# EAGLE design PJ24 (EAGLE 7.4.0)

## Sheet 1 of 4: AFE4404
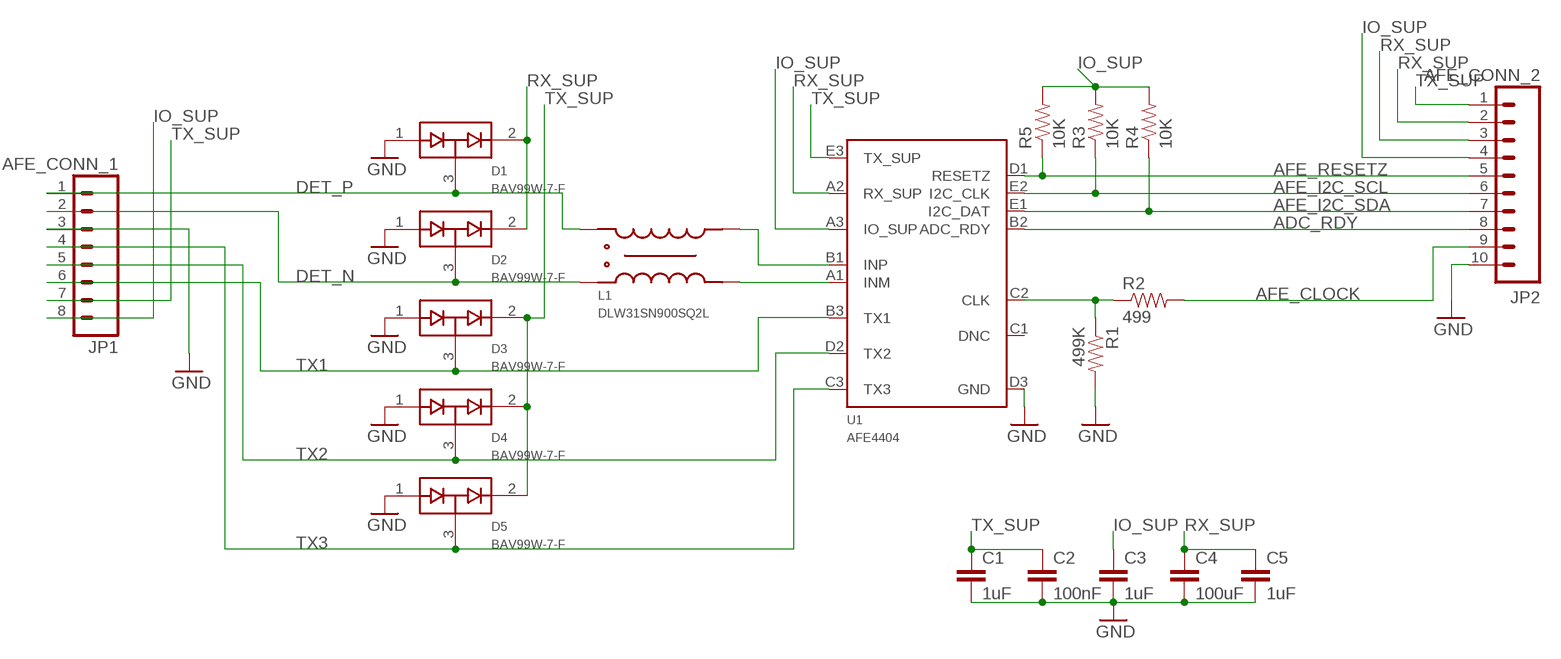
[diagram p0: schematic, sheet 1]

### Parts
C1  1uF  CAP0402-S  [0402-S]
C2  100nF  CAP0402-S  [0402-S]
C3  1uF  CAP0402-S  [0402-S]
C4  100uF  CAP0402-S  [0402-S]
C5  1uF  CAP0402-S  [0402-S]
D1  BAV99W-7-F  BAV99W  [SOT323]
D2  BAV99W-7-F  BAV99W  [SOT323]
D3  BAV99W-7-F  BAV99W  [SOT323]
D4  BAV99W-7-F  BAV99W  [SOT323]
D5  BAV99W-7-F  BAV99W  [SOT323]
JP1  AFE_CONN_1  M08BM08B-SRSS-TB  [BM08B-SRSS-TB]
JP2  AFE_CONN_2  M10SMD_MALE  [1X10_SMD_MALE]
L1  DLW31SN900SQ2L  [DLW31SN900SQ2L]
R1  499K  RESISTOR0402-S  [0402-S]
R2  499  RESISTOR0402-S  [0402-S]
R3  10K  RESISTOR0402-S  [0402-S]
R4  10K  RESISTOR0402-S  [0402-S]
R5  10K  RESISTOR0402-S  [0402-S]
U1  AFE4404  [DSBGA-3X5]

### Nets
ADC_RDY: JP2.8 U1.B2(ADC_RDY) ; also sheet 2
AFE_CLOCK: JP2.9 R2.2 ; also sheet 2
AFE_I2C_SCL: JP2.6 R3.1 U1.E2(I2C_CLK) ; also sheet 2
AFE_I2C_SDA: JP2.7 R4.1 U1.E1(I2C_DAT) ; also sheet 2
AFE_RESETZ: JP2.5 R5.1 U1.D1(RESETZ) ; also sheet 2
DET_N: D2.3(COM) JP1.2 L1.4 ; also sheet 4
DET_P: D1.3(COM) JP1.1 L1.1 ; also sheet 4
GND: C1.2 C2.2 C3.2 C4.2 C5.2 D1.1(A1) D2.1(A1) D3.1(A1) D4.1(A1) D5.1(A1) JP1.3 JP2.10 R1.2 U1.D3(GND) ; also sheet 2,3,4
IO_SUP: C3.1 JP1.8 JP2.4 R3.2 R4.2 R5.2 U1.A3(IO_SUP) ; also sheet 3,4
N$1: L1.2 U1.B1(INP)
N$2: L1.3 U1.A1(INM)
N$3: R1.1 R2.1 U1.C2(CLK)
RX_SUP: C4.1 C5.1 D1.2(C2) D2.2(C2) JP2.2 JP2.3 U1.A2(RX_SUP) ; also sheet 3
TX1: D3.3(COM) JP1.6 U1.B3(TX1) ; also sheet 4
TX2: D4.3(COM) JP1.5 U1.D2(TX2) ; also sheet 4
TX3: D5.3(COM) JP1.4 U1.C3(TX3) ; also sheet 4
TX_SUP: C1.1 C2.1 D3.2(C2) D4.2(C2) D5.2(C2) JP1.7 JP2.1 U1.E3(TX_SUP) ; also sheet 3,4
Unconnected: U1.C1(DNC)

## Sheet 2 of 4: Microcontroller
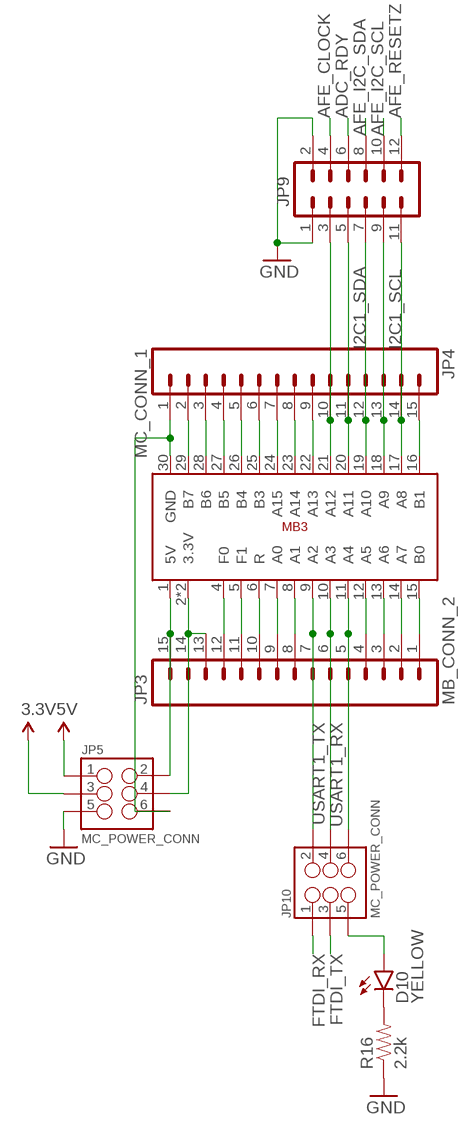
[diagram p1: schematic, sheet 2]

### Parts
D10  YELLOW  LED-YELLOW1206  [LED-1206]
JP3  MB_CONN_2  M15LOCK  [1X15_LOCK]
JP4  MC_CONN_1  M15LOCK  [1X15_LOCK]
JP5  MC_POWER_CONN  M03X2SMT  [2X3_SMT_POSTS]
JP9  M06X2FEMALE-SMT  [2X6_SMD]
JP10  MC_POWER_CONN  M03X2SMT  [2X3_SMT_POSTS]
R16  2.2k  2.2KOHM-1/10W-1%(0603)  [0603-RES]
U2  MB3  [MB3]

### Nets
3.3V: JP5.3 ; also sheet 3
5V: JP5.1 ; also sheet 3
ADC_RDY: JP9.6 ; also sheet 1
AFE_CLOCK: JP9.4 ; also sheet 1
AFE_I2C_SCL: JP9.10 ; also sheet 1
AFE_I2C_SDA: JP9.8 ; also sheet 1
AFE_RESETZ: JP9.12 ; also sheet 1
FTDI_RX: JP10.1 ; also sheet 3
FTDI_TX: JP10.3 ; also sheet 3
GND: JP5.5 JP9.1 JP9.2 R16.1 ; also sheet 1,3,4
I2C1_SCL: JP4.13 JP9.9 U2.18(A9)
I2C1_SDA: JP4.12 JP9.7 U2.19(A10)
N$4: JP3.15 JP5.2 U2.1(5V)
N$5: JP3.13 JP3.14 JP5.4 U2.2(3.3V) U2.3(3.3V)
N$6: JP3.12 U2.4(F0)
N$7: JP3.11 U2.5(F1)
N$8: JP3.10 U2.6(R)
N$9: JP3.9 U2.7(A0)
N$10: JP3.8 U2.8(A1)
N$11: D10.C R16.2
N$12: D10.A JP10.5
N$13: JP3.5 JP10.6 U2.11(A4)
N$14: JP3.4 U2.12(A5)
N$15: JP3.3 U2.13(A6)
N$16: JP3.2 U2.14(A7)
N$17: JP3.1 U2.15(B0)
N$18: JP4.1 JP5.6 U2.30(GND)
N$19: JP4.2 U2.29(B7)
N$20: JP4.3 U2.28(B6)
N$21: JP4.4 U2.27(B5)
N$22: JP4.5 U2.26(B4)
N$23: JP4.6 U2.25(B3)
N$24: JP4.7 U2.24(A15)
N$25: JP4.8 U2.23(A14)
N$26: JP4.9 U2.22(A13)
N$27: JP4.10 JP9.3 U2.21(A12)
N$28: JP4.11 JP9.5 U2.20(A11)
N$31: JP4.14 JP9.11 U2.17(A8)
N$32: JP4.15 U2.16(B1)
USART1_RX: JP3.6 JP10.4 U2.10(A3)
USART1_TX: JP3.7 JP10.2 U2.9(A2)

## Sheet 3 of 4: Power
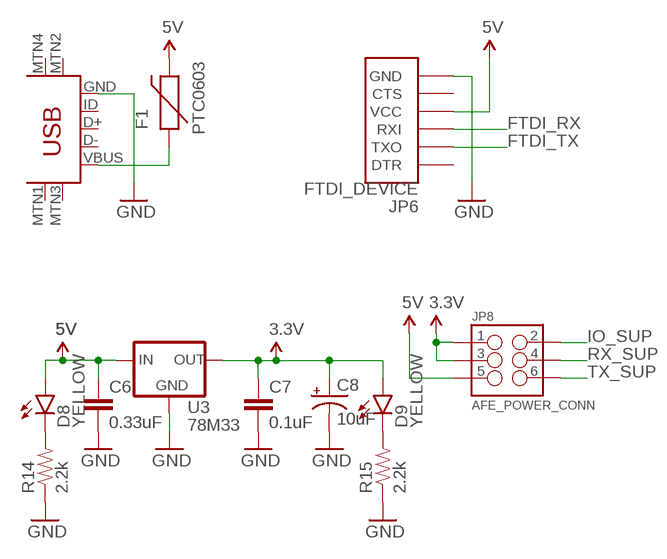
[diagram p2: schematic, sheet 3]

### Parts
C6  0.33uF  0.33UF-50V-10%(0805)  [0805-CAP]
C7  0.1uF  0.33UF-50V-10%(0805)  [0805-CAP]
C8  10uF  10UF-16V-10%(TANT)  [EIA3216]
D8  YELLOW  LED-YELLOW1206  [LED-1206]
D9  YELLOW  LED-YELLOW1206  [LED-1206]
F1  PTC0603  [0603]
JP6  FTDI_DEVICE  [FTDI_DEVICE_SIDE]
JP8  AFE_POWER_CONN  M03X2SMT  [2X3_SMT_POSTS]
R14  2.2k  2.2KOHM-1/10W-1%(0603)  [0603-RES]
R15  2.2k  2.2KOHM-1/10W-1%(0603)  [0603-RES]
U3  78M33  V_REG_78XX7812  [TO-252]
U$1  USB-MINIB-5PIN  [USB-MINIB]

### Nets
3.3V: C7.1 C8.A(+) D9.A JP8.1 JP8.3 U3.2(OUT) ; also sheet 2
5V: C6.1 D8.A F1.2 JP6.P$4(VCC) JP8.5 U3.1(IN) ; also sheet 2
FTDI_RX: JP6.P$3(RXI) ; also sheet 2
FTDI_TX: JP6.P$2(TXO) ; also sheet 2
GND: C6.2 C7.2 C8.C(-) JP6.P$6(GND) R14.1 R15.1 U3.3(GND) U$1.GND ; also sheet 1,2,4
IO_SUP: JP8.2 ; also sheet 1,4
N$42: D8.C R14.2
N$43: D9.C R15.2
N$44: F1.1 U$1.VBUS
RX_SUP: JP8.4 ; also sheet 1
TX_SUP: JP8.6 ; also sheet 1,4
Unconnected: JP6.P$1(DTR) JP6.P$5(CTS) U$1.D+ U$1.D- U$1.ID U$1.MTN1(MTN2) U$1.MTN2(MTN3) U$1.MTN3(MTN1) U$1.MTN4

## Sheet 4 of 4: LED
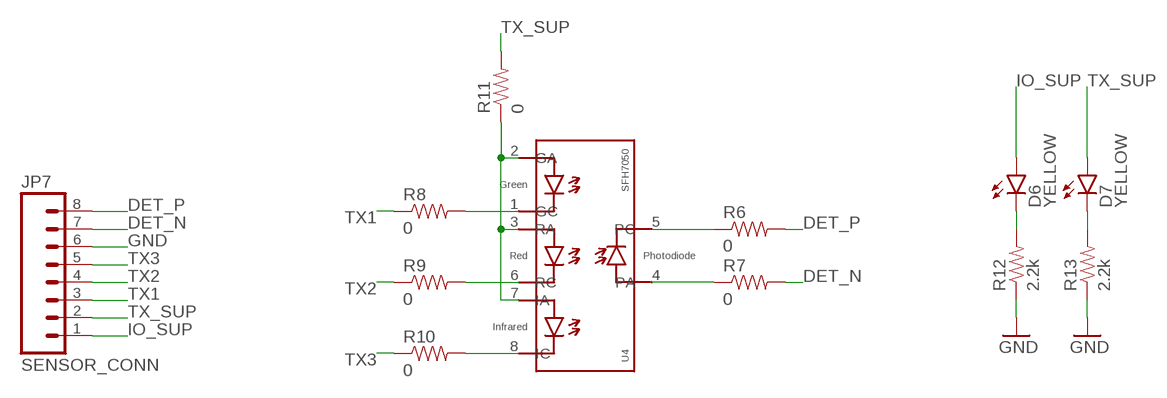
[diagram p3: schematic, sheet 4]

### Parts
D6  YELLOW  LED-YELLOW1206  [LED-1206]
D7  YELLOW  LED-YELLOW1206  [LED-1206]
JP7  SENSOR_CONN  M08BM08B-SRSS-TB  [BM08B-SRSS-TB]
R6  0  RESISTOR0402-S  [0402-S]
R7  0  RESISTOR0402-S  [0402-S]
R8  0  RESISTOR0402-S  [0402-S]
R9  0  RESISTOR0402-S  [0402-S]
R10  0  RESISTOR0402-S  [0402-S]
R11  0  RESISTOR0402-S  [0402-S]
R12  2.2k  2.2KOHM-1/10W-1%(0603)  [0603-RES]
R13  2.2k  2.2KOHM-1/10W-1%(0603)  [0603-RES]
U4  SFH7050  [SFH7050]

### Nets
DET_N: JP7.7 R7.2 ; also sheet 1
DET_P: JP7.8 R6.2 ; also sheet 1
GND: JP7.6 R12.1 R13.1 ; also sheet 1,2,3
IO_SUP: D6.A JP7.1 ; also sheet 1,3
N$33: R9.2 U4.6(RC)
N$34: R11.1 U4.2(GA) U4.3(RA) U4.7(IA)
N$35: R10.2 U4.8(IC)
N$36: D6.C R12.2
N$37: R8.2 U4.1(GC)
N$38: D7.C R13.2
N$39: R7.1 U4.4(PA)
N$40: R6.1 U4.5(PC)
TX1: JP7.3 R8.1 ; also sheet 1
TX2: JP7.4 R9.1 ; also sheet 1
TX3: JP7.5 R10.1 ; also sheet 1
TX_SUP: D7.A JP7.2 R11.2 ; also sheet 1,3

## Library data of the parts
C1-C5 = SparkFun-Capacitors:CAP: Capacitor Standard 0603 ceramic capacitor, and 0.1" leaded capacitor.
C6 = SparkFun-Capacitors:0.33UF-50V-10%(0805): CAP-08469; PROD_ID: CAP-08469
C7 = SparkFun-Capacitors:0.33UF-50V-10%(0805): CAP-08469; PROD_ID: CAP-08469; VALUE: 0.33uF
C8 = SparkFun-Capacitors:10UF-16V-10%(TANT): CAP-00811 1206/EIA-3216 Tantalum capacitor; PROD_ID: CAP-00811
D1-D5 = SparkFun-DiscreteSemi:BAV99: Two small signal silicon diodes connected anode to cathode. Connections to all three nodes available. DIO-10647
D6-D10 = SparkFun-LED:LED-YELLOW: Yellow SMD LEDs LilyPad 1206- DIO-09909 0603- DIO-09003 "SMART" means more efficient and expensive; PROD_ID: DIO-00820
F1 = SparkFun-PowerIC:PTC: Resettable Fuse PTC Resettable Fuse. Spark Fun Electronics SKU : COM-08357
JP1 JP7 = SparkFun-Connectors:M08: Header 8 Standard 8-pin 0.1" header. Use with straight break away headers (SKU : PRT-00116), right angle break away headers (PRT-00553), swiss pins (PRT-00743), machine pins (PRT-00117), and female headers (PRT-00115).
JP2 = SparkFun-Connectors:M10: Header 10 Standard 10-pin 0.1" header. Use with straight break away headers (SKU : PRT-00116), right angle break away headers (PRT-00553), swiss pins (PRT-00743), machine pins (PRT-00117), and female headers (PRT-00115).; PROD_ID: CONN-11291
JP3 JP4 = SparkFun-Connectors:M15: Header 15 Standard 15-pin 0.1" header. Use with straight break away headers (SKU : PRT-00116), right angle break away headers (PRT-00553), swiss pins (PRT-00743), machine pins (PRT-00117), and female headers (PRT-00115).
JP5 JP8 JP10 = SparkFun-Connectors:M03X2: 2x3 .1" header. Shrouded, with keying- CONN-10681 SMT- CONN-11415 Pogo pins- HW-11044; PROD_ID: CONN-11415
JP6 = SparkFun-Connectors:FTDI_DEVICE: Connector which mates to FTDI basic or FTDI cable.
JP9 = SparkFun-Connectors:M06X2
L1 = PJ24:DLW31SN900SQ2L
R1-R11 = SparkFun-Resistors:RESISTOR: Resistor Basic schematic elements and footprints for 0603, 1206, and PTH resistors.
R12-R16 = SparkFun-Resistors:2.2KOHM-1/10W-1%(0603): RES-08272; PROD_ID: RES-08272
U1 = PJ24:AFE4404
U2 = L21:MB3
U3 = SparkFun-PowerIC:V_REG_78XX: Voltage Regulator Standard 78xx regulator. IGO (Input Ground Output). Spark Fun Electronics SKU : COM-00107; PROD_ID: VREG-12370; VALUE: +12v
U4 = PJ20:SFH7050
U$1 = SparkFun-Connectors:USB-MINIB: Mini-USB "B" connector with 5th pin broken out. Created new symbol breaking out 5th "ID" pin in mini/micro USB connector spec. See: http://en.wikipedia.org/wiki/Mini_usb#Cables. Uses same footprint as 4-pin symbol. Also added pins to connect to mounting / shield pads if required (probably not generally needed as signals aren't shielded once they leave the connector).; PROD_ID: CONN-08193

## Board
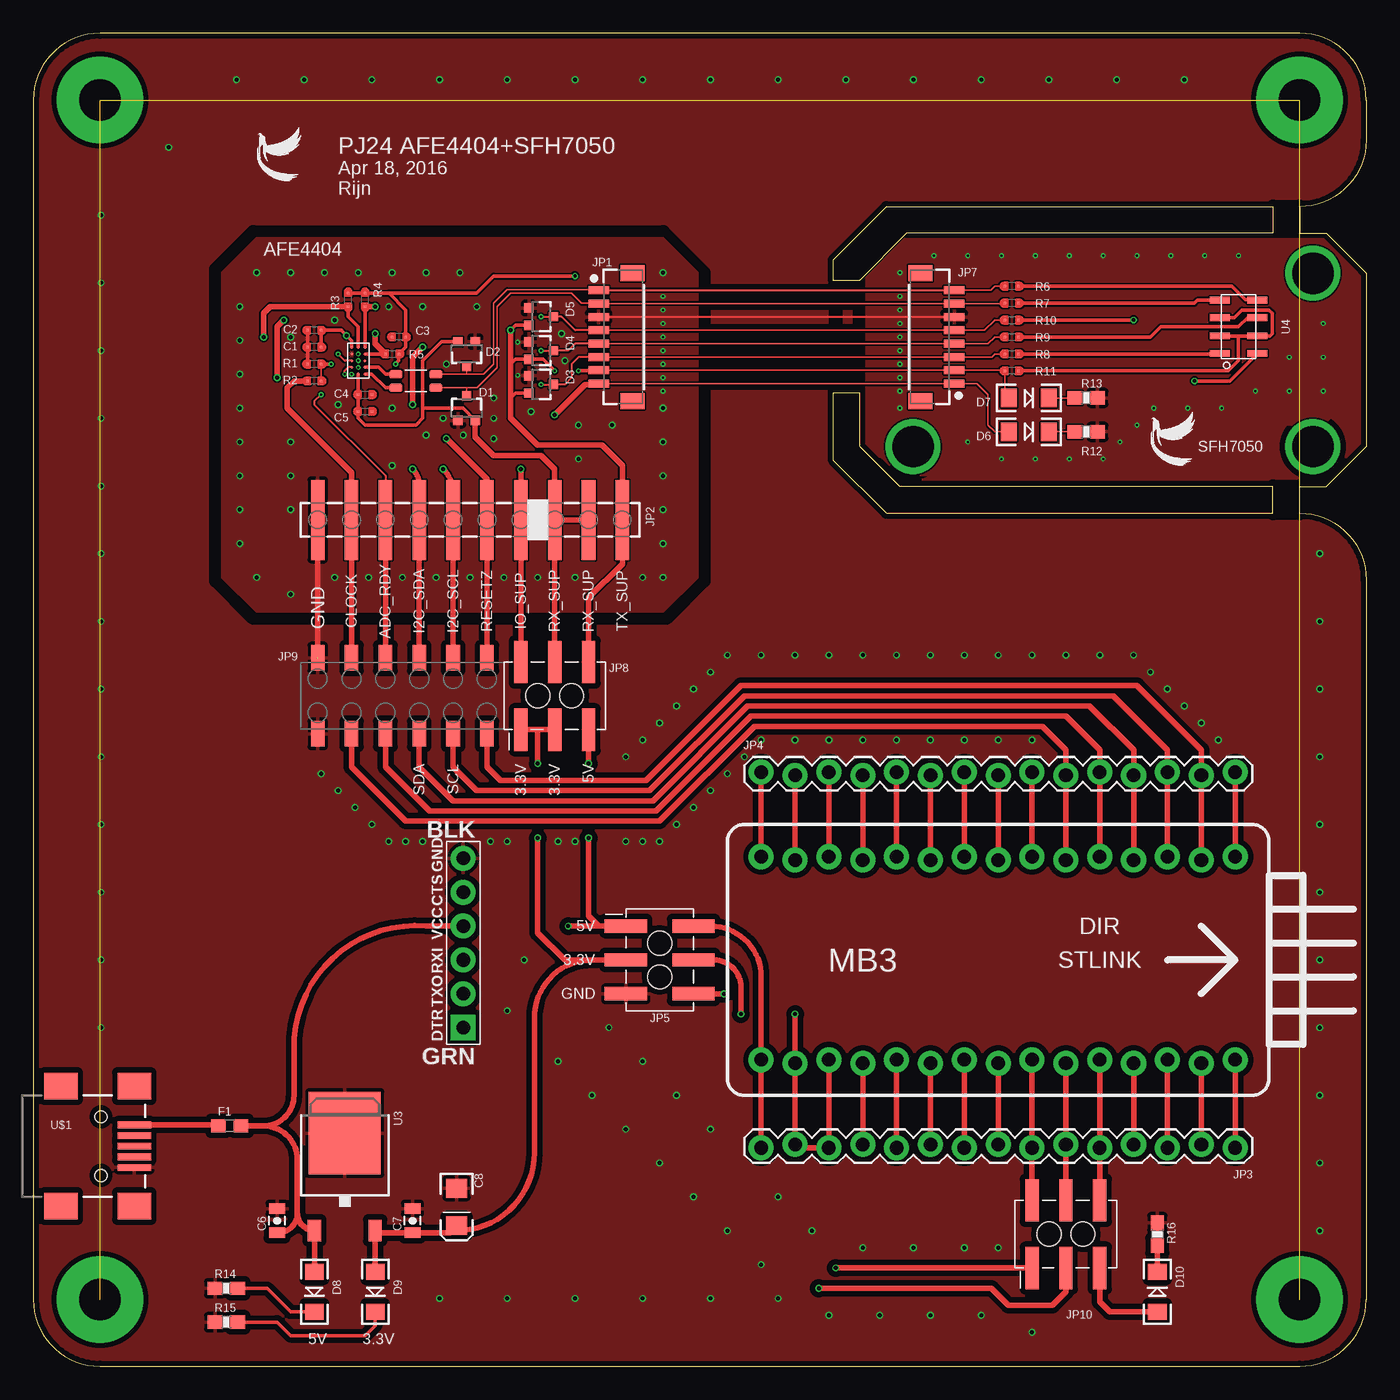
[diagram p4: board, top side]
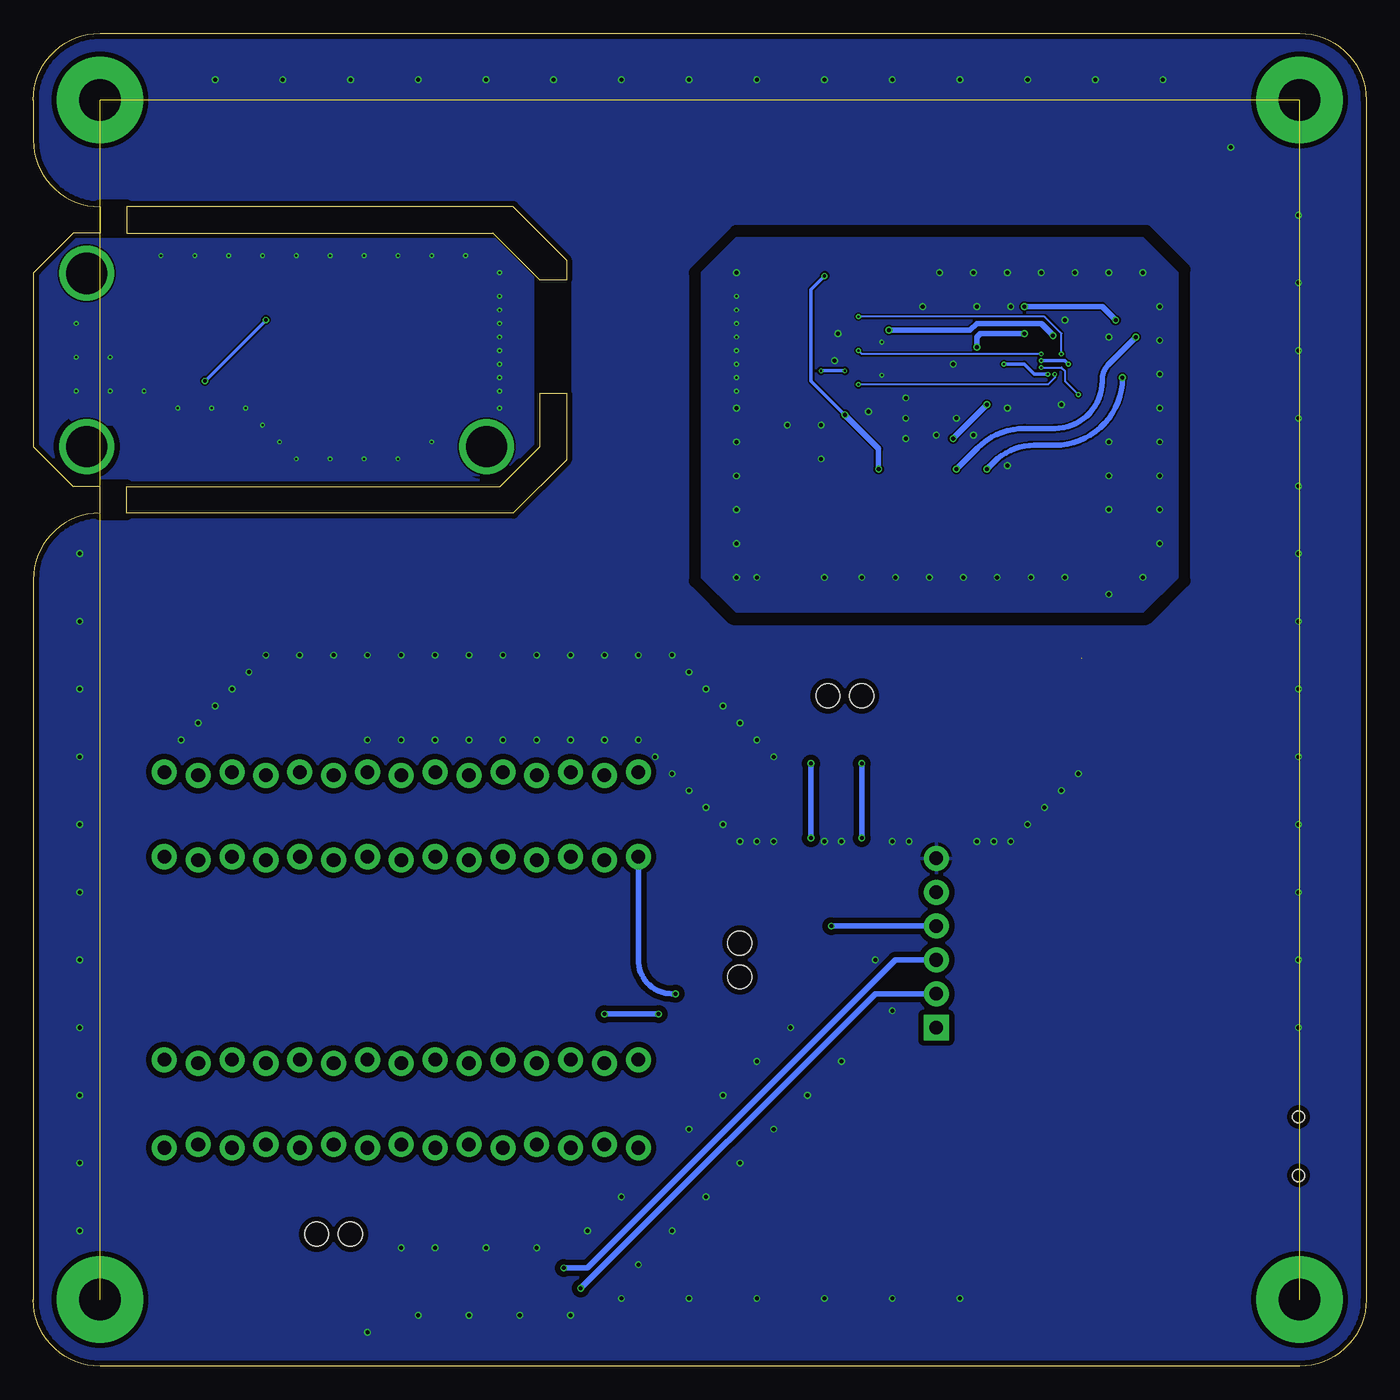
[diagram p5: board, bottom side, seen from below]

Size 100 x 100 mm. Coordinates in mm from the lower left corner, seen from the top.
Outline: 0,95 0,5 arc90 5,0 95,0 arc90 100,5 100,59 arc90 95,64 95,66 97,66 100,69 100,82 97,85 95,85 95,87 arc90 100,92 100,95 arc90 95,100 5,100 arc90 0,95
Outline: 64,87 60,83 60,81.5 62,81.5 65.5,85 93,85 93,87 64,87
Outline: 65,66 62,69 62,73 60,73 60,68 64,64 93,64 93,66 65,66
Copper layers (1*16): Top 0.035mm / dielectric 1.5mm / Bottom 0.035mm
Design rules "default *": minimum track width 5mil, minimum drill 6mil, track to track 5mil, track to pad 5mil, pad to pad 5mil, via to via 5mil, smd to smd 5mil, copper to edge 5mil, drill to drill 5mil, minimum pad ring 4mil, minimum via ring 4mil, stop-mask expansion 4mil, vias tented up to drill 18mil, thermal gap 10mil
tRestrict: 14 lines
bRestrict: 14 lines

### Footprints (pad centres in the part's own frame; a part is rotated, then mirrored left to right if it is on the bottom)
0402-S = smd 0.152 x 0.152: 1 -0.508,0; 2 0.508,0
0805-CAP = smd 0.8 x 1.2: 1 -0.9,0; 2 0.9,0
EIA3216 = smd 1.4 x 1.6: A 1.4,0; C -1.4,0
SOT323 = smd 0.7 x 0.7: 1 -0.65,-0.925; 2 0.65,-0.925; 3 0,0.925
LED-1206 = smd 1.2 x 1.4: A -1.5,0; C 1.5,0
0603 = smd 1.1 x 1: 1 -0.85,0; 2 0.85,0
BM08B-SRSS-TB = smd 0.6 x 1.55: 1 -3.5,0; 2 -2.5,0; 3 -1.5,0; 4 -0.5,0; 5 0.5,0; 6 1.5,0; 7 2.5,0; 8 3.5,0 | smd 1.2 x 1.8: P$9 4.8,2.525; P$10 -4.8,2.525
1X10_SMD_MALE = smd 1.02 x 6: 1 0,0; 2 2.54,0; 3 5.08,0; 4 7.62,0; 5 10.16,0; 6 12.7,0; 7 15.24,0; 8 17.78,0; 9 20.32,0; 10 22.86,0
1X15_LOCK = drill 1.016 pad 1.88: 1 0,0.127; 2 2.54,-0.127; 3 5.08,0.127; 4 7.62,-0.127; 5 10.16,0.127; 6 12.7,-0.127; 7 15.24,0.127; 8 17.78,-0.127; 9 20.32,0.127; 10 22.86,-0.127; 11 25.4,0.127; 12 27.94,-0.127; 13 30.48,0.127; 14 33.02,-0.127; 15 35.56,0.127
2X3_SMT_POSTS = smd 1 x 3.17: 1 -2.54,-2.54; 2 -2.54,2.54; 3 0,-2.54; 4 0,2.54; 5 2.54,-2.54; 6 2.54,2.54 | hole 1.8: -1.27,0; 1.27,0
FTDI_DEVICE_SIDE = drill 1.016 pad 1.88 square: P$1 -6.35,0 | drill 1.016 pad 1.88: P$2 -3.81,0; P$3 -1.27,0; P$4 1.27,0; P$5 3.81,0; P$6 6.35,0
2X6_SMD = smd 1.02 x 1.9: 1 -5.08,-2.85; 2 -5.08,2.85; 3 -2.54,-2.85; 4 -2.54,2.85; 5 0,-2.85; 6 0,2.85; 7 2.54,-2.85; 8 2.54,2.85; 9 5.08,-2.85; 10 5.08,2.85; 11 7.62,-2.85; 12 7.62,2.85
DLW31SN900SQ2L = smd 1 x 0.6: 1 1.5,0.5; 2 -1.5,0.5; 3 -1.5,-0.5; 4 1.5,-0.5
0402-S' = smd 0.152 x 0.152: 1 -0.5,0; 2 0.5,0
0603-RES = smd 1.1 x 1: 1 -0.85,0; 2 0.85,0
DSBGA-3X5 = smd 0.23 x 0.23: A1 -0.5,1; A2 0,1; A3 0.5,1; B1 -0.5,0.5; B2 0,0.5; B3 0.5,0.5; C1 -0.5,0; C2 0,0; C3 0.5,0; D1 -0.5,-0.5; D2 0,-0.5; D3 0.5,-0.5; E1 -0.5,-1; E2 0,-1; E3 0.5,-1
MB3 = drill 1.016 pad 1.88: 1 0,0.127; 2 2.54,-0.127; 3 5.08,0.127; 4 7.62,-0.127; 5 10.16,0.127; 6 12.7,-0.127; 7 15.24,0.127; 8 17.78,-0.127; 9 20.32,0.127; 10 22.86,-0.127; 11 25.4,0.127; 12 27.94,-0.127; 13 30.48,0.127; 14 33.02,-0.127; 15 35.56,0.127; 16 35.56,15.367; 17 33.02,15.113; 18 30.48,15.367; 19 27.94,15.113; 20 25.4,15.367; 21 22.86,15.113; 22 20.32,15.367; 23 17.78,15.113; 24 15.24,15.367; 25 12.7,15.113; 26 10.16,15.367; 27 7.62,15.113; 28 5.08,15.367; 29 2.54,15.113; 30 0,15.367
TO-252 = smd 1 x 1.6: 1 -2.28,-4.8; 2 2.28,-4.8 | smd 5.4 x 6.2: 3 0,2.5
SFH7050 = smd 0.5 x 1.5: 1 -2,1.4; 2 -0.69,1.4; 3 0.69,1.4; 4 2,1.4; 5 2,-1.4; 6 0.69,-1.4; 7 -0.69,-1.4; 8 -2,-1.4
USB-MINIB = smd 2.5 x 0.5: D+ 2.5,0; D- 2.5,0.8; GND 2.5,-1.6; ID 2.5,-0.8; VBUS 2.5,1.6 | smd 2.5 x 2: MTN1 -3,4.5; MTN2 2.5,4.5; MTN3 -3,-4.5; MTN4 2.5,-4.5 | hole 0.9: 0,2.2; 0,-2.2

### Placement (x,y rotation side)
C1  21.08,76.45 180 top
C2  21.08,77.72 180 top
C3  27.43,77.22 180 top
C4  24.89,72.9 0 top
C5  24.89,71.63 0 top
C6  18.29,10.92 90 top
C7  28.45,10.92 90 top
C8  31.75,11.94 270 top
D1  32.51,75.95 180 top
D2  32.51,71.88 0 top
D3  38.1,73.66 270 top
D4  38.1,76.2 270 top
D5  38.1,78.74 270 top
D6  74.68,70.1 0 top
D7  74.68,72.64 0 top
D8  21.08,5.59 270 top
D9  25.65,5.59 270 top
D10  84.33,5.59 90 top
F1  14.73,18.03 0 top
JP1  42.42,77.22 270 top
JP2  44.2,63.5 180 top
JP3  90.17,16.51 180 top
JP4  54.61,44.45 0 top
JP5  46.99,30.48 270 top
JP6  32.26,31.75 90 top
JP7  69.09,77.22 90 top
JP8  39.12,50.29 0 top
JP9  26.42,50.29 0 top
JP10  77.47,9.91 0 top
L1  28.7,73.91 0 top
R1  499K  [0402-S']  21.08,75.18 180 top
R2  499  [0402-S']  21.08,73.91 180 top
R3  10K  [0402-S']  23.62,80.01 90 top
R4  10K  [0402-S']  24.89,80.01 90 top
R5  10K  [0402-S']  26.92,75.95 0 top
R6  0  [0402-S']  73.41,81.03 180 top
R7  0  [0402-S']  73.41,79.76 180 top
R8  0  [0402-S']  73.41,75.95 0 top
R9  0  [0402-S']  73.41,77.22 0 top
R10  0  [0402-S']  73.41,78.49 0 top
R11  0  [0402-S']  73.41,74.68 180 top
R12  78.99,70.1 180 top
R13  78.99,72.64 180 top
R14  14.48,5.84 0 top
R15  14.48,3.3 0 top
R16  84.33,9.91 270 top
U1  24.38,75.44 180 top
U2  54.61,22.86 0 top
U3  23.37,14.99 0 top
U4  90.42,77.98 90 top
U$1  5.08,16.51 0 top
U$2  [LOGO]  83.82,67.56 0 top
U$3  [LOGO]  16.76,88.9 0 top

### Tracks (layer width: path | path; a pad name or v marks a point on that pad's centre or on a via)
3.3V  (via drill 0.3)
  Top 0.406: D9.A arc-90 D9.A U3.2 arc90 25.81,10.02 C7.1 31.23,10.02 arc90 C8.A 31.75,10.16 arc90 37.59,16 37.59,26.16 arc-90 41.91,30.48 JP5.3 39.88,30.48 37.85,32.51 v37.85,39.62 | JP8.1 37.85,47.75 | 37.85,47.75 JP8.3 | v37.85,45.21 37.85,47.75
  Bottom 0.406: v37.85,39.62 v37.85,45.21
5V  (via drill 0.3)
  Top 0.406: F1.2 17.27,18.03 | 17.27,18.03 arc-90 19.81,15.49 19.81,11.46 | 19.81,11.46 arc90 U3.1 D8.A arc-90 D8.A | C6.1 18.37,10.02 arc90 19.81,11.46 | JP6.P$4 29.46,33.02 arc90 19.56,24.64 19.56,20.32 arc-90 17.27,18.03 | JP8.5 v41.66,45.21 | v41.66,39.62 41.66,33.78 42.42,33.02 | 42.42,33.02 JP5.1 | v40.13,33.02 42.42,33.02
  Bottom 0.406: v41.66,45.21 v41.66,39.62 | JP6.P$4 v40.13,33.02
ADC_RDY  (via drill 0.15)
  Top 0.152: v24.38,74.93 U1.B2 | v21.59,72.9 21.08,72.39 21.08,72.14 26.42,66.8 JP2.8
  Top 0.406: JP2.8 JP9.6
  Bottom 0.152: v24.38,74.93 22.86,74.93 22.61,74.68 22.61,73.91 v21.59,72.9
AFE_CLOCK
  Top 0.406: R2.2 19.56,73.91 19.05,73.41 19.05,71.88 23.88,67.06 JP2.9 JP9.4
AFE_I2C_SCL  (via drill 0.3)
  Top 0.254: U1.E2 24.38,77.98 23.62,78.74 R3.1
  Top 0.406: R3.1 17.78,79.5 17.27,78.99 v17.27,77.22 | v30.73,67.31 arc-45 31.5,65.47 JP2.6 JP9.10 31.5,52.83
  Bottom 0.406: v30.73,67.31 29.15,68.89 arc45 25.61,70.36 23.37,70.36 arc-90 19.81,73.91 arc45 19.27,75.22 v17.27,77.22
AFE_I2C_SDA  (via drill 0.3)
  Top 0.254: U1.E1 24.89,76.44 R4.1
  Top 0.406: v18.8,78.49 18.29,77.98 v18.29,74.17 | v25.65,79.5 R4.1 | v28.45,67.31 arc-45 28.96,66.08 JP2.7 JP9.8
  Bottom 0.406: v18.8,78.49 19.81,79.5 v25.65,79.5 | v28.45,67.31 27.93,67.83 arc45 24.89,69.09 23.37,69.09 arc-90 v18.29,74.17
AFE_RESETZ  (via drill 0.3)
  Top 0.254: U1.D1 26.42,75.94 R5.1
  Top 0.406: v30.99,69.6 34.04,66.55 JP2.5 JP9.12 | v28.45,72.14 28.45,75.69 v29.21,76.45 | v25.65,77.47 25.65,76.72 R5.1
  Bottom 0.406: v30.99,69.6 v28.45,72.14 | v29.21,76.45 29.21,77.22 28.96,77.47 v25.65,77.47
DET_N
  Top 0.127: L1.4 32.51,73.41 | 32.51,73.41 33.28,73.41 34.8,74.93 34.8,79.5 35.81,80.52 40.39,80.52 41.15,79.76 42.38,79.76 JP1.2 JP7.7 72.87,79.72 R7.2 | D2.3 32.51,73.41
DET_P
  Top 0.127: L1.1 32.51,74.41 | 32.51,74.41 33.77,74.41 34.54,75.18 34.54,79.76 35.56,80.77 42.36,80.77 JP1.1 | D1.3 32.51,74.41 | JP7.8 71.83,80.72 72.14,81.03 R6.2
  Top 0.152: JP1.1 JP7.8
FTDI_RX  (via drill 0.3)
  Top 0.406: v60.2,7.37 JP10.1
  Bottom 0.406: JP6.P$3 35.31,30.48 58.42,7.37 v60.2,7.37
FTDI_TX  (via drill 0.3)
  Top 0.406: v58.93,5.84 71.88,5.84 73.15,4.57 76.45,4.57 77.47,5.59 JP10.3
  Bottom 0.406: JP6.P$2 36.83,27.94 v58.93,5.84
GND  (via drill 0.15, 0.3)  (1 unrouted)
  Top 0.152: 42.42,78.74 69.09,78.74
  Top 0.254: R1.2 20.58,76.45 C1.2 C2.2
  Top 0.406: JP2.10 21.34,53.09
  other vias: 16.76,82.04 26.92,71.88 22.86,72.14 19.3,77.22 22.61,78.49 26.67,79.5 29.21,79.5 33.27,79.5 30.99,75.18 30.73,71.12 32.26,69.85 34.54,72.64 34.54,71.12 34.54,69.6 37.34,71.63 39.88,75.44 39.62,77.47 36.35,76.83 36.35,74.35 19.3,82.04 21.84,82.04 24.38,82.04 26.92,82.04 29.46,82.04 32,82.04 47.24,82.04 47.24,80.26 47.24,71.88 47.24,69.34 47.24,66.8 47.24,64.26 47.24,61.72 47.24,59.18 45.72,59.18 40.64,59.18 37.85,59.18 35.31,59.18 19.3,57.91 16.76,59.18 15.49,61.72 15.49,64.26 15.49,66.8 15.49,69.34 15.49,71.88 15.49,74.42 15.49,76.96 15.49,79.5 19.3,69.34 19.3,66.8 19.3,64.26 26.92,67.56 29.46,69.85 40.89,70.61 43.43,70.61 40.89,68.07 80.26,68.07 77.72,68.07 70.1,69.34 72.64,68.07 75.18,68.07 82.8,70.61 96.77,73.15 94.23,73.15 91.69,73.15 89.15,71.88 86.61,71.88 84.07,71.88 81.53,69.34 94.23,75.69 96.77,75.69 96.77,78.23 90.42,83.31 87.88,83.31 85.34,83.31 82.8,83.31 80.26,83.31 77.72,83.31 75.18,83.31 72.64,83.31 70.1,83.31 67.56,83.31 65.02,82.04 65.02,71.88 32.77,59.18 30.23,59.18 27.69,59.18 25.15,59.18 22.61,59.18 47.24,79.25 47.24,78.23 47.24,77.22 47.24,76.2 47.24,75.18 47.24,74.17 47.24,73.15 65.02,80.26 65.02,79.25 65.02,78.23 65.02,77.22 65.02,76.2 65.02,75.18 65.02,74.17 65.02,73.15 5.08,71.12 5.08,76.2 5.08,81.28 5.08,86.36 10.16,91.44 15.24,96.52 20.32,96.52 25.4,96.52 30.48,96.52 35.56,96.52 40.64,96.52 45.72,96.52 50.8,96.52 55.88,96.52 60.96,96.52 66.04,96.52 71.12,96.52 76.2,96.52 81.28,96.52 86.36,96.52 5.08,66.04 5.08,60.96 5.08,55.88 5.08,50.8 5.08,45.72 5.08,40.64 5.08,35.56 5.08,30.48 5.08,25.4 30.48,5.08 35.56,5.08 40.64,5.08 45.72,5.08 50.8,5.08 55.88,5.08 96.52,10.16 96.52,15.24 96.52,20.32 96.52,25.4 96.52,30.48 96.52,35.56 96.52,40.64 96.52,45.72 96.52,50.8 96.52,55.88 96.52,60.96 21.59,44.45 22.86,43.18 24.13,41.91 25.4,40.64 26.67,39.37 27.94,39.37 29.21,39.37 34.29,39.37 35.56,39.37 39.37,39.37 40.64,39.37 44.45,45.72 45.72,46.99 46.99,48.26 48.26,49.53 49.53,50.8 50.8,52.07 52.07,53.34 54.61,53.34 57.15,53.34 59.69,53.34 62.23,53.34 64.77,53.34 67.31,53.34 69.85,53.34 72.39,53.34 74.93,53.34 77.47,53.34 80.01,53.34 82.55,53.34 83.82,52.07 85.09,50.8 86.36,49.53 87.63,48.26 88.9,46.99 44.45,39.37 45.72,39.37 46.99,39.37 48.26,40.64 49.53,41.91 50.8,43.18 52.07,44.45 53.34,45.72 54.61,46.99 57.15,46.99 59.69,46.99 62.23,46.99 64.77,46.99 67.31,46.99 69.85,46.99 72.39,46.99 74.93,46.99 36.83,30.48 35.56,26.67 39.37,22.86 41.91,20.32 44.45,17.78 46.99,15.24 49.53,12.7 52.07,10.16 54.61,7.62 43.18,25.4 45.72,22.86 48.26,20.32 50.8,17.78 55.88,12.7 58.42,10.16 62.23,8.89 59.69,3.81 63.5,3.81 67.31,3.81 71.12,3.81 74.93,2.54 66.04,8.89 69.85,8.89 72.39,8.89
  pour Top (rank 4): 14.22,82.04 16.76,84.58 47.24,84.58 49.78,82.04 49.78,59.18 47.24,56.64 16.76,56.64 14.22,59.18
  pour Bottom (rank 4): 49.78,82.04 47.24,84.58 16.76,84.58 14.22,82.04 14.22,59.18 16.76,56.64 47.24,56.64 49.78,59.18
  pour Top (rank 4): 62.48,82.04 65.02,84.58 96.77,84.58 99.31,82.04 99.31,73.15 96.77,70.61 85.34,70.61 81.53,66.8 65.02,66.8 62.48,69.34
  pour Bottom (rank 4): 62.48,82.04 65.02,84.58 96.77,84.58 99.31,82.04 99.31,73.15 96.77,70.61 85.34,70.61 81.53,66.8 65.02,66.8 62.48,69.34
  pour Bottom (isolate 0.406, rank 6): 0,101.6 15.24,101.6 15.24,111.76 25.4,111.76 25.4,101.6 101.6,101.6 101.6,0 0,0
  pour Top (isolate 0.406, rank 6): 0,0 0,111.76 10.16,111.76 10.16,101.6 101.6,101.6 101.6,0
I2C1_SCL
  Top 0.406: JP9.9 31.5,44.96 33.27,43.18 46.23,43.18 53.34,50.29 81.03,50.29 85.09,46.23 JP4.13 U2.18
I2C1_SDA
  Top 0.406: JP9.7 28.96,44.96 31.5,42.42 46.48,42.42 53.59,49.53 79.25,49.53 82.55,46.23 JP4.12 U2.19
IO_SUP  (via drill 0.15, 0.25, 0.3)
  Top 0.127: D6.A 72.14,70.1 71.63,70.61 71.63,72.9 70.81,73.72 JP7.1 JP1.8
  Top 0.254: R3.2 R4.2 26.68,80.51 | 26.68,80.51 27.94,79.25 C3.1 27.94,76.46 R5.2 27.42,75.43 v27.18,75.18 | 26.68,80.51 26.69,80.52 33.27,80.52 34.54,81.79 v40.64,81.79 | v23.88,74.42 U1.A3
  Top 0.406: v36.58,67.31 JP2.4 JP8.2 | v39.12,71.37 41.4,73.66 42.36,73.66 JP1.8
  Bottom 0.254: v27.18,75.18 25.65,75.18 24.89,74.42 v23.88,74.42 | v40.64,81.79 41.66,80.77 41.66,73.91 v39.12,71.37
  Bottom 0.406: v36.58,67.31 36.58,68.83 v39.12,71.37
N$1
  Top 0.254: U1.B1 25.9,74.94 26.42,74.42 26.94,74.42 L1.2
N$2
  Top 0.254: U1.A1 25.38,74.44 26.42,73.41 26.94,73.41 L1.3
N$3  (via drill 0.15)
  Top 0.127: R1.1 R2.1
  Top 0.254: v22.35,75.18 R1.1
  Bottom 0.254: U1.C2 22.61,75.44 v22.35,75.18
  other vias: 24.38,75.44
N$4
  Top 0.406: JP5.2 50.8,33.02 arc-90 54.61,29.21 U2.1 JP3.15
N$5  (via drill 0.3)
  Top 0.406: JP5.4 51.05,30.48 arc-90 53.09,28.45 v53.09,26.42 | v57.15,26.42 U2.2 57.15,16.76 JP3.14 | U2.3 JP3.13 57.4,16.38 JP3.14 | 57.15,16.51 JP3.14
  Bottom 0.406: v53.09,26.42 v57.15,26.42
N$6
  Top 0.406: U2.4 JP3.12
N$7
  Top 0.406: U2.5 JP3.11
N$8
  Top 0.406: U2.6 JP3.10
N$9
  Top 0.406: U2.7 JP3.9
N$10
  Top 0.406: U2.8 JP3.8
N$11
  Top 0.406: D10.C R16.2 84.33,9.14
N$12
  Top 0.406: JP10.5 80.01,4.83 80.77,4.06 84.3,4.06 D10.A
N$13
  Top 0.406: U2.11 JP3.5 JP10.6
N$14
  Top 0.406: JP3.4 U2.12
N$15
  Top 0.406: U2.13 JP3.3
N$16
  Top 0.406: U2.14 JP3.2
N$17
  Top 0.406: U2.15 JP3.1
N$18  (via drill 0.3)
  Top 0.406: JP5.6 v51.82,27.94 | JP4.1 U2.30
  Bottom 0.406: v51.82,27.94 52.07,27.94 arc90 54.61,30.48 U2.30
N$19
  Top 0.406: JP4.2 U2.29
N$20
  Top 0.406: JP4.3 U2.28
N$21
  Top 0.406: U2.27 JP4.4
N$22
  Top 0.406: JP4.5 U2.26
N$23
  Top 0.406: U2.25 JP4.6
N$24
  Top 0.406: JP4.7 U2.24
N$25
  Top 0.406: JP4.8 U2.23
N$26
  Top 0.406: JP4.9 U2.22
N$27
  Top 0.406: JP9.3 23.88,44.96 27.94,40.89 46.99,40.89 54.1,48.01 75.69,48.01 77.47,46.23 JP4.10 U2.21
N$28
  Top 0.406: JP9.5 26.42,44.96 29.72,41.66 46.74,41.66 53.85,48.77 77.47,48.77 80.01,46.23 JP4.11 U2.20
N$29  (via drill 3.1)
  other vias: 66,69
N$30  (via drill 3.1)
  other vias: 96,69
N$31
  Top 0.406: JP9.11 34.04,44.96 35.05,43.94 45.97,43.94 53.09,51.05 82.8,51.05 87.63,46.23 JP4.14 U2.17
N$32
  Top 0.406: JP4.15 U2.16
N$33
  Top 0.254: R9.2 83.82,77.22 84.58,77.98 90.42,77.98 91.11,78.67 U4.6
N$34
  Top 0.254: R11.1 89.66,74.68 90.42,75.44 90.42,77.22 90.35,77.29 U4.2 U4.7 92.78,77.29 92.96,77.47 92.96,78.99 92.71,79.25 90.68,79.25 90.1,78.67 U4.3
N$35  (via drill 0.25)
  Top 0.254: R10.2 v82.55,78.49 | v87.12,73.91 89.76,73.91 U4.8
  Bottom 0.254: v82.55,78.49 v87.12,73.91
N$36
  Top 0.127: D6.C R12.2
N$37
  Top 0.254: R8.2 88.99,75.95 U4.1
N$38
  Top 0.127: D7.C R13.2
N$39
  Top 0.254: R7.1 87.12,79.76 87.34,79.98 U4.4
N$40
  Top 0.254: R6.1 89.92,81.03 90.93,80.01 91.79,80.01 U4.5
N$41  (via drill 3.1 pad 6.45)  (3 unrouted)
  other vias: 5,95 95,95 95,5 5,5
N$42
  Top 0.254: R14.2 17.53,5.84 19.3,4.06 21.06,4.06 D8.C
N$43
  Top 0.254: R15.2 18.29,3.3 19.3,2.29 24.89,2.29 25.65,3.05 D9.C
N$44
  Top 0.406: U$1.VBUS 13.79,18.11 arc90 13.97,18.29 F1.1
N$45  (via drill 3.1)
  other vias: 96,82
RX_SUP
  Top 0.254: U1.A2 C4.1 C5.1 24.38,71.12 24.89,70.61 28.7,70.61 29.21,71.12 29.21,71.88 | D1.2 30.64,76.87 29.21,75.44 29.21,71.88 | 29.21,71.88 32.24,71.88 D2.2
  Top 0.406: JP2.2 JP2.3 | JP2.3 39.12,67.31 38.1,68.33 34.54,68.33 33.16,69.71 D2.2 | JP2.3 JP8.4
TX1  (via drill 0.15)
  Top 0.127: R8.1 72.14,75.95 71.91,75.72 JP7.3 JP1.6
  Top 0.152: U1.B3 23.63,74.94 23.37,74.68 v23.37,74.42 | v38.1,73.66 D3.3 39.88,73.66 40.39,74.17 40.39,75.18 40.92,75.72 JP1.6
  Bottom 0.152: v23.37,74.42 23.37,74.17 23.88,73.66 v38.1,73.66
TX2  (via drill 0.15)
  Top 0.127: R9.1 72.14,77.22 71.64,76.72 JP7.4 JP1.5
  Top 0.152: v38.1,76.2 D4.3 40.13,76.2 40.65,76.72 JP1.5 | U1.D2 v24.38,75.95
  Bottom 0.152: v24.38,75.95 37.85,75.95 v38.1,76.2
TX3  (via drill 0.15)
  Top 0.127: R10.1 72.14,78.49 71.37,77.72 JP7.5 JP1.4
  Top 0.152: U1.C3 23.37,75.44 v22.86,75.95 | v38.1,78.74 D5.3 39.62,78.74 40.65,77.72 JP1.4
  Bottom 0.152: v22.86,75.95 22.86,77.47 24.13,78.74 v38.1,78.74
TX_SUP  (via drill 0.15, 0.3)
  Top 0.127: D7.A 72.91,72.91 R11.2 72.87,74.72 JP7.2 JP1.7
  Top 0.254: 21.61,76.44 C1.1 C2.1 23.11,77.72 23.11,77.7 v23.5,77.32 23.88,76.93 U1.E3 | D5.2 36.18,78.09 v35.81,77.72 | 35.81,75.18 36.18,75.55 D4.2 38.24,75.55 v39.12,74.68 | D3.2 36.18,73.01 35.81,72.64 | v40.89,74.68 42.38,74.68 JP1.7
  Top 0.406: v35.81,77.72 35.81,75.18 35.81,72.64 35.81,71.12 37.85,69.09 42.67,69.09 44.2,67.56 JP2.1 44.2,60.2 41.66,57.66 JP8.6
  Bottom 0.254: v39.12,74.68 v40.89,74.68
  Bottom 0.406: v35.81,77.72 29.72,77.72 29.21,78.23 24.38,78.23 23.5,77.34 v23.5,77.32
USART1_RX
  Top 0.406: U2.10 JP3.6 JP10.4
USART1_TX
  Top 0.406: U2.9 JP3.7 JP10.2

### Text on the board
tNames: PJ24 AFE4404+SFH7050 | Apr 18, 2016 | Rijn | AFE4404 | SFH7050 | GND | CLOCK | ADC_RDY | I2C_SDA | I2C_SCL | RESETZ | IO_SUP | RX_SUP | RX_SUP | TX_SUP | SDA | SCL | 3.3V | 3.3V | 5V | 5V | 3.3V | GND | 5V | 3.3V